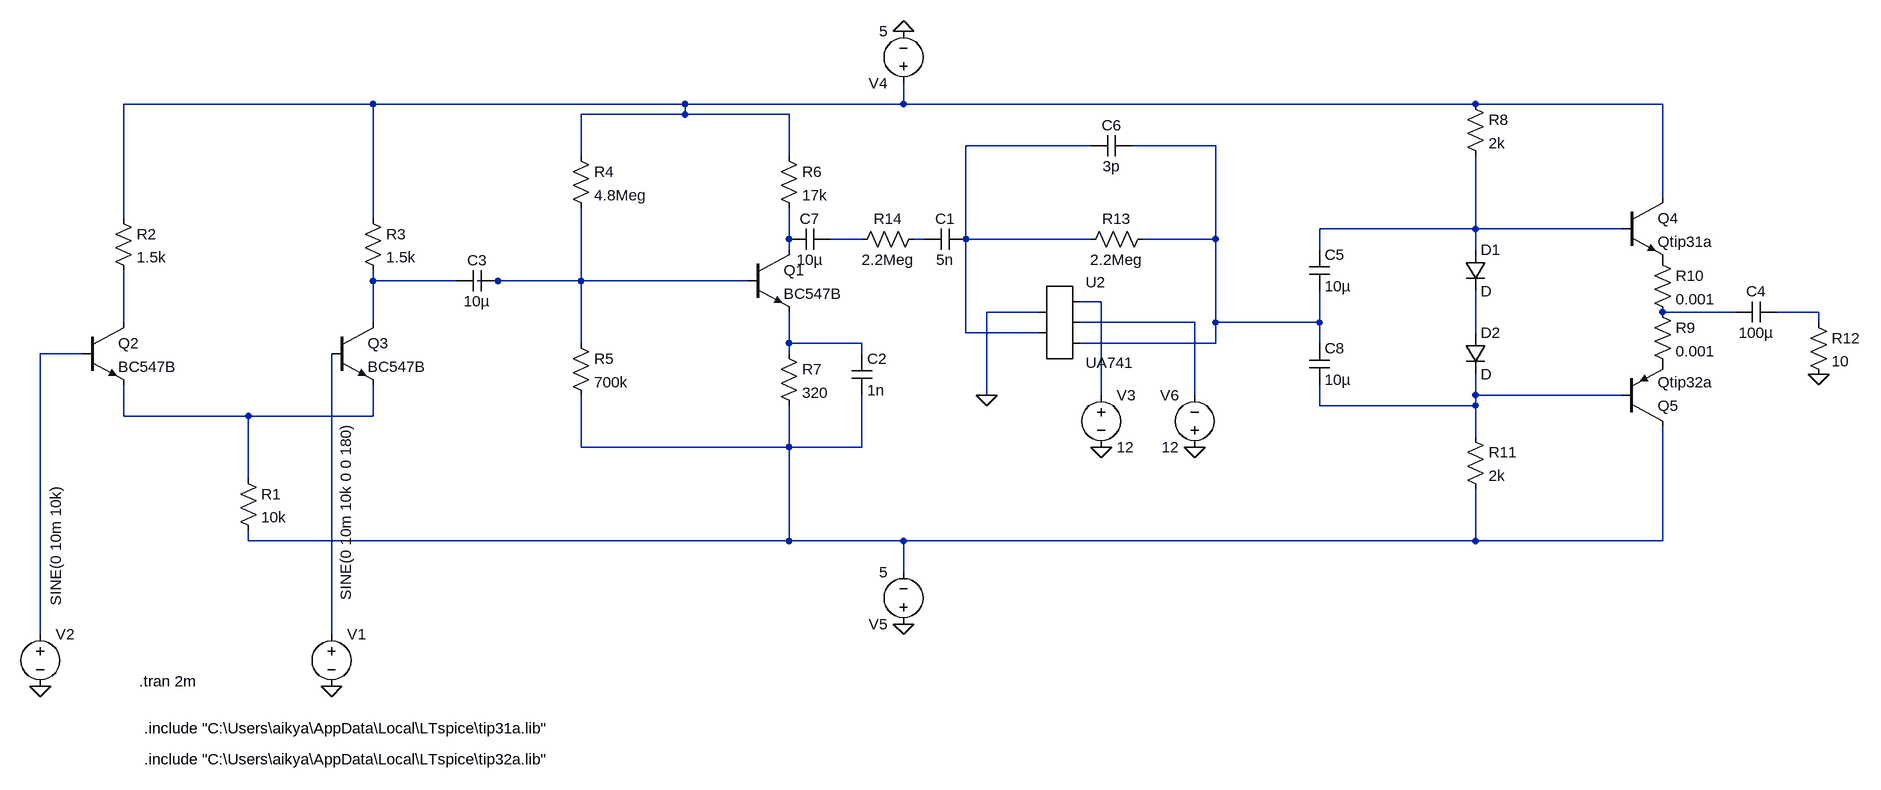
[diagram p0: schematic final.asc]
final.asc, the LTspice schematic file:
Version 4
SHEET 1 1892 832
WIRE -624 -192 -1008 -192
WIRE -144 -192 -624 -192
WIRE 192 -192 192 -224
WIRE 192 -192 -144 -192
WIRE 1072 -192 192 -192
WIRE 1360 -192 1072 -192
WIRE -144 -176 -144 -192
WIRE -144 -176 -304 -176
WIRE 16 -176 -144 -176
WIRE 480 -128 288 -128
WIRE 672 -128 544 -128
WIRE -304 -112 -304 -176
WIRE 16 -112 16 -176
WIRE 1360 -48 1360 -192
WIRE -1008 -16 -1008 -192
WIRE -624 -16 -624 -192
WIRE 1072 0 1072 -112
WIRE 1072 0 832 0
WIRE 1296 0 1072 0
WIRE 16 16 16 -32
WIRE 128 16 80 16
WIRE 224 16 208 16
WIRE 288 16 288 -128
WIRE 480 16 288 16
WIRE 672 16 672 -128
WIRE 672 16 560 16
WIRE 16 32 16 16
WIRE 832 32 832 0
WIRE 1072 32 1072 0
WIRE -624 80 -624 64
WIRE -496 80 -624 80
WIRE -432 80 -464 80
WIRE -304 80 -304 -32
WIRE -304 80 -432 80
WIRE -48 80 -304 80
WIRE 496 112 464 112
WIRE 400 128 320 128
WIRE 1472 128 1360 128
WIRE 1600 128 1536 128
WIRE -1008 144 -1008 64
WIRE -624 144 -624 80
WIRE 640 144 464 144
WIRE 672 144 672 16
WIRE 832 144 832 96
WIRE 832 144 672 144
WIRE 1600 144 1600 128
WIRE 288 160 288 16
WIRE 400 160 288 160
WIRE 1072 160 1072 96
WIRE -304 176 -304 80
WIRE 16 176 16 128
WIRE 128 176 16 176
WIRE 672 176 672 144
WIRE 672 176 464 176
WIRE 832 176 832 144
WIRE -1072 192 -1136 192
WIRE 16 192 16 176
WIRE 128 192 128 176
WIRE 320 256 320 128
WIRE 496 256 496 112
WIRE 640 256 640 144
WIRE 1072 256 1072 224
WIRE 1296 256 1072 256
WIRE 832 272 832 240
WIRE 1072 272 1072 256
WIRE 1072 272 832 272
WIRE -1008 288 -1008 240
WIRE -816 288 -1008 288
WIRE -624 288 -624 240
WIRE -624 288 -816 288
WIRE 1072 320 1072 272
WIRE -304 336 -304 256
WIRE 16 336 16 272
WIRE 16 336 -304 336
WIRE 128 336 128 256
WIRE 128 336 16 336
WIRE -816 384 -816 288
WIRE -816 480 -816 464
WIRE 16 480 16 336
WIRE 16 480 -816 480
WIRE 192 480 16 480
WIRE 1072 480 1072 400
WIRE 1072 480 192 480
WIRE 1360 480 1360 304
WIRE 1360 480 1072 480
WIRE 192 528 192 480
WIRE -1136 624 -1136 192
WIRE -688 624 -688 192
FLAG -1136 704 0
FLAG -688 704 0
FLAG 320 256 0
FLAG 192 -304 0
FLAG 192 608 0
FLAG 496 336 0
FLAG 640 336 0
FLAG 1600 224 0
DATAFLAG 1600 128 ""
DATAFLAG 1600 128 ""
DATAFLAG 1600 128 ""
DATAFLAG 1360 128 ""
SYMBOL voltage -1136 608 R0
WINDOW 123 0 0 Left 0
WINDOW 39 0 0 Left 0
WINDOW 3 24 -213 VRight 2
SYMATTR Value SINE(0 10m 10k)
SYMATTR InstName V2
SYMBOL npn -1072 144 R0
SYMATTR InstName Q2
SYMATTR Value BC547B
SYMBOL npn -688 144 R0
SYMATTR InstName Q3
SYMATTR Value BC547B
SYMBOL res -832 368 R0
SYMATTR InstName R1
SYMATTR Value 10k
SYMBOL res -1024 -32 R0
SYMATTR InstName R2
SYMATTR Value 1.5k
SYMBOL res -640 -32 R0
SYMATTR InstName R3
SYMATTR Value 1.5k
SYMBOL voltage 192 -208 R180
WINDOW 123 0 0 Left 0
WINDOW 39 0 0 Left 0
SYMATTR InstName V4
SYMATTR Value 5
SYMBOL voltage 192 624 R180
WINDOW 123 0 0 Left 0
WINDOW 39 0 0 Left 0
SYMATTR InstName V5
SYMATTR Value 5
SYMBOL cap -432 64 R90
WINDOW 0 0 32 VBottom 2
WINDOW 3 32 32 VTop 2
SYMATTR InstName C3
SYMATTR Value 10µ
SYMBOL res -320 -128 R0
SYMATTR InstName R4
SYMATTR Value 4.8Meg
SYMBOL res -320 160 R0
SYMATTR InstName R5
SYMATTR Value 700k
SYMBOL npn -48 32 R0
SYMATTR InstName Q1
SYMATTR Value BC547B
SYMBOL res 0 -128 R0
SYMATTR InstName R6
SYMATTR Value 17k
SYMBOL res 0 176 R0
SYMATTR InstName R7
SYMATTR Value 320
SYMBOL voltage -688 608 R0
WINDOW 123 0 0 Left 0
WINDOW 39 0 0 Left 0
WINDOW 3 22 -309 VRight 2
SYMATTR Value SINE(0 10m 10k 0 0 180)
SYMATTR InstName V1
SYMBOL cap 288 0 R90
WINDOW 0 0 32 VBottom 2
WINDOW 3 32 32 VTop 2
SYMATTR InstName C1
SYMATTR Value 5n
SYMBOL cap 112 192 R0
SYMATTR InstName C2
SYMATTR Value 1n
SYMBOL res 1056 -208 R0
SYMATTR InstName R8
SYMATTR Value 2k
SYMBOL res 1056 304 R0
SYMATTR InstName R11
SYMATTR Value 2k
SYMBOL cap 544 -144 R90
WINDOW 0 0 32 VBottom 2
WINDOW 3 32 32 VTop 2
SYMATTR InstName C6
SYMATTR Value 3p
SYMBOL res 576 0 R90
WINDOW 0 0 56 VBottom 2
WINDOW 3 32 56 VTop 2
SYMATTR InstName R13
SYMATTR Value 2.2Meg
SYMBOL res 224 0 R90
WINDOW 0 0 56 VBottom 2
WINDOW 3 32 56 VTop 2
SYMATTR InstName R14
SYMATTR Value 2.2Meg
SYMBOL AutoGenerated\\UA741 432 144 R0
SYMATTR InstName U2
SYMBOL voltage 496 240 R0
WINDOW 123 0 0 Left 0
WINDOW 39 0 0 Left 0
SYMATTR InstName V3
SYMATTR Value 12
SYMBOL voltage 640 352 R180
WINDOW 0 24 96 Left 2
WINDOW 3 24 16 Left 2
WINDOW 123 0 0 Left 0
WINDOW 39 0 0 Left 0
SYMATTR InstName V6
SYMATTR Value 12
SYMBOL cap 80 0 R90
WINDOW 0 0 32 VBottom 2
WINDOW 3 32 32 VTop 2
SYMATTR InstName C7
SYMATTR Value 10µ
SYMBOL npn 1296 -48 R0
SYMATTR InstName Q4
SYMATTR Value Qtip31a
SYMBOL cap 1536 112 R90
WINDOW 0 0 32 VBottom 2
WINDOW 3 32 32 VTop 2
SYMATTR InstName C4
SYMATTR Value 100µ
SYMBOL res 1584 128 R0
SYMATTR InstName R12
SYMATTR Value 10
SYMBOL res 1344 112 R0
SYMATTR InstName R9
SYMATTR Value 0.001
SYMBOL res 1344 32 R0
SYMATTR InstName R10
SYMATTR Value 0.001
SYMBOL diode 1056 32 R0
SYMATTR InstName D1
SYMBOL diode 1056 160 R0
SYMATTR InstName D2
SYMBOL pnp 1296 304 M180
SYMATTR InstName Q5
SYMATTR Value Qtip32a
SYMBOL cap 816 32 R0
SYMATTR InstName C5
SYMATTR Value 10µ
SYMBOL cap 816 176 R0
SYMATTR InstName C8
SYMATTR Value 10µ
TEXT -984 696 Left 2 !.tran 2m
TEXT -976 768 Left 2 !.include "C:\\Users\\aikya\\AppData\\Local\\LTspice\\tip31a.lib"
TEXT -976 816 Left 2 !.include "C:\\Users\\aikya\\AppData\\Local\\LTspice\\tip32a.lib"

The netlist it stands for:
* final.asc
V2 N017 0 SINE(0 10m 10k)
Q2 N013 N017 N019 0 BC547B
Q3 N008 N021 N019 0 BC547B
R1 N019 N020 10k
R2 N001 N013 1.5k
R3 N001 N008 1.5k
V4 N001 0 5
V5 0 N020 5
C3 N009 N008 10µ
R4 N001 N009 4.8Meg
R5 N009 N020 700k
Q1 N005 N009 N016 0 BC547B
R6 N001 N005 17k
R7 N016 N020 320
V1 N021 0 SINE(0 10m 10k 0 0 180)
C1 N002 N007 5n
C2 N016 N020 1n
R8 N001 N004 2k
R11 N018 N020 2k
C6 N003 N002 3p
R13 N003 N002 2.2Meg
R14 N007 N006 2.2Meg
* U2: UA741 (symbol AutoGenerated\UA741 not available, pins judged from their places): pin1=0 pin2=N002 pin3=N010 pin4=N014 pin5=N003
V3 N010 0 12
V6 0 N014 12
C7 N006 N005 10µ
Q4 N001 N004 P001 0 Qtip31a
C4 N012 N011 100µ
R12 N012 0 10
R9 N011 P002 0.001
R10 P001 N011 0.001
D1 N004 N015 D
D2 N015 N018 D
Q5 N020 N018 P002 0 Qtip32a
C5 N004 N003 10µ
C8 N003 N018 10µ
.model D D
.lib standard.dio
.model NPN NPN
.model PNP PNP
.lib standard.bjt
.tran 2m
.include "C:\Users\aikya\AppData\Local\LTspice\tip31a.lib"
.include "C:\Users\aikya\AppData\Local\LTspice\tip32a.lib"
.backanno
.end